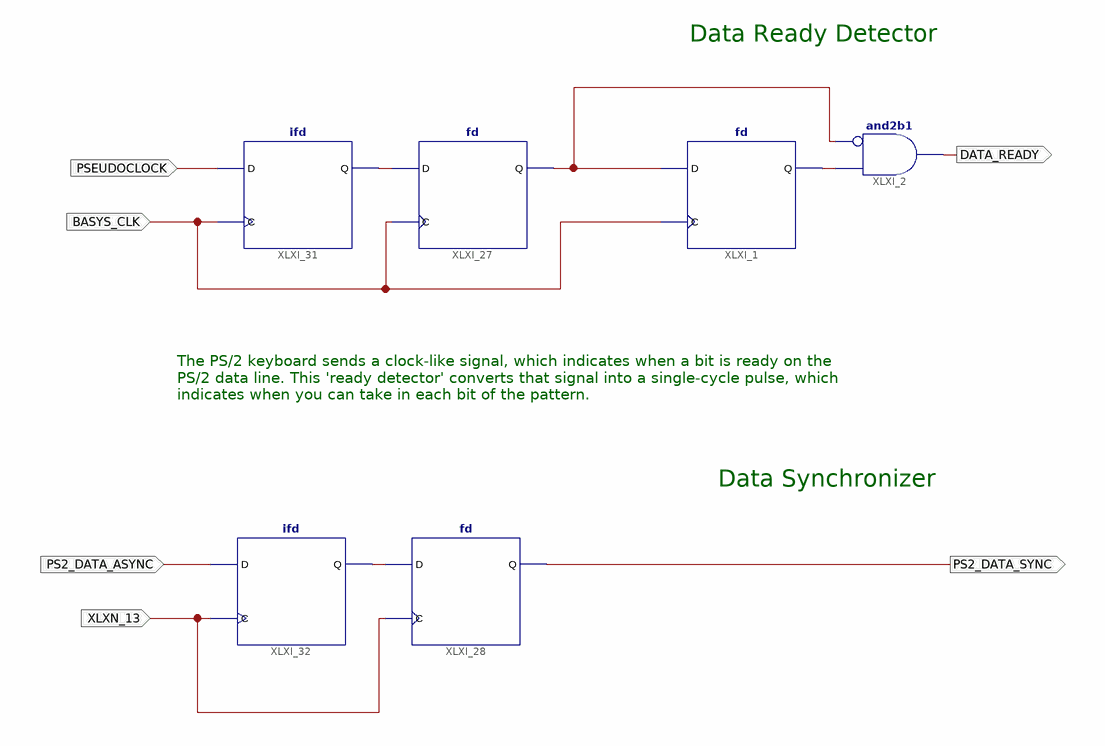
[diagram p0: schematic sheet 1]
// Xilinx ISE schematic KeyboardSync.sch (spartan3e) as structural Verilog: 6 symbols, 6 ports
module KeyboardSync (
  input  PSEUDOCLOCK,
  input  BASYS_CLK,
  input  PS2_DATA_ASYNC,
  input  XLXN_13,
  output DATA_READY,
  output PS2_DATA_SYNC
);

  wire XLXN_3, XLXN_4, XLXN_9, XLXN_HID;

  fd XLXI_1 (.C(BASYS_CLK), .D(XLXN_3), .Q(XLXN_4));
  and XLXI_2 (DATA_READY, ~XLXN_3, XLXN_4);  // and2b1
  fd XLXI_27 (.C(BASYS_CLK), .D(XLXN_HID), .Q(XLXN_3));
  fd XLXI_28 (.C(XLXN_13), .D(XLXN_9), .Q(PS2_DATA_SYNC));
  ifd XLXI_31 (.C(BASYS_CLK), .D(PSEUDOCLOCK), .Q(XLXN_HID));
  ifd XLXI_32 (.C(XLXN_13), .D(PS2_DATA_ASYNC), .Q(XLXN_9));

  // Notes on the sheet:
  //   Data Ready Detector
  //   The PS/2 keyboard sends a clock-like signal, which indicates when a bit is ready on the
  //   PS/2 data line. This 'ready detector' converts that signal into a single-cycle pulse, which
  //   indicates when you can take in each bit of the pattern.
  //   Data Synchronizer
endmodule
